# Altium project FIT_PM12_v1.1.PrjPcb (part 4 of 13)

## Sheet PM12_P3V3.SchDoc: FIT_PM12 board
size 420 x 297 mm; CheckedBy: G.Kasprowicz; Author: INR Moscow; CompanyName: WUT ISE; DrawnBy: M.Podgórski; Organization: WUT ISE; Address1: PW ISE; Address2: Nowowiejska 15/19 00-665 Warsaw; Address3: gkasprow@gmail.com; DocumentNumber: 16; Revision: 2; SheetNumber: 17; SheetTotal: 34; ModifiedBy: -; CheckedDate: -; Title2: P3V3 PSU; DivGrp: WUT ISE; Designer: INR RAS; ModifiedDate: -; ProjectName: Sensor Box
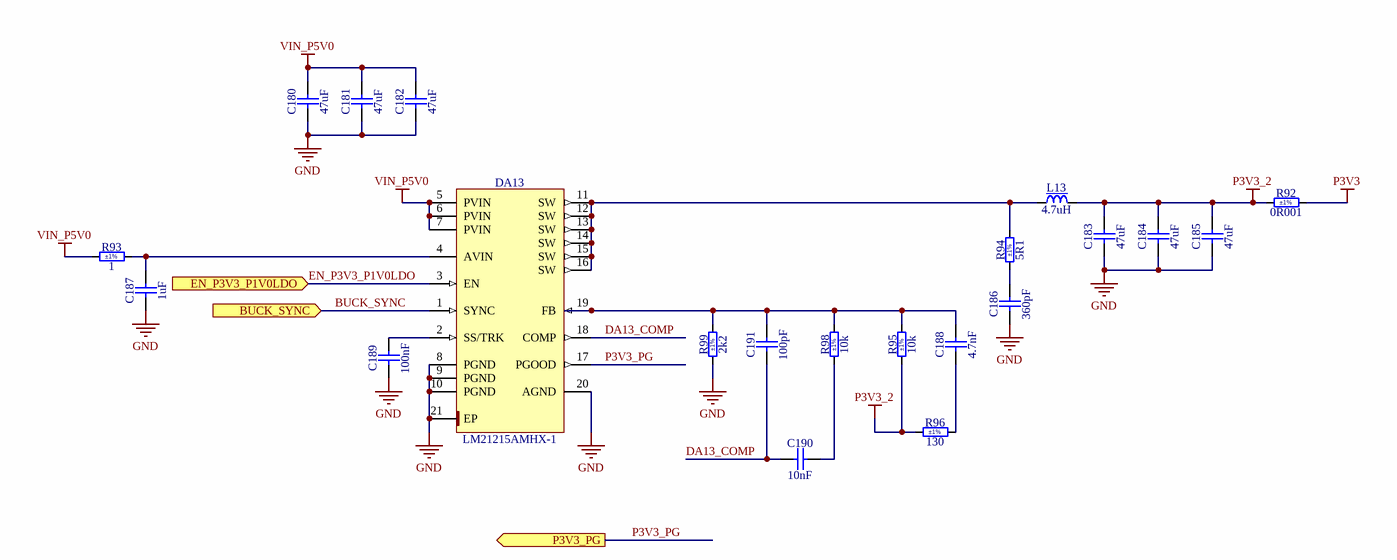
[diagram p9: PM12_P3V3.SchDoc]

### Parts
C180  47uF  [CAPC3225X270N]
C181  47uF  [CAPC3225X270N]
C182  47uF  [CAPC3225X270N]
C183  47uF  [CAPC3225X270N]
C184  47uF  [CAPC3225X270N]
C185  47uF  [CAPC3225X270N]
C186  360pF  [CAPC2013X145N]
C187  1uF  [CAPC2012X140N]
C188  4.7nF  [CAPC2012X135N]
C189  100nF  [CAPC2012X135N]
C190  10nF  [CAPC2012X135N]
C191  100pF  [CAPC2012X135N]
DA13  LM21215AMHX-1  [TEXAS_PWP0020AA]
L13  4.7uH  [INDM172170X700N]
R92  0R001  Tolerance: ±1%  [RESC_BOURNS_CRE2512_0R001-0R004]
R93  1  Tolerance: ±1%  [RESC2012X60N]
R94  5R1  Tolerance: ±1%  [RESC2012X60N]
R95  10k  Tolerance: ±1%  [RESC2012X60N]
R96  130  Tolerance: ±1%  [RESC2012X60N]
R98  10k  Tolerance: ±1%  [RESC2012X60N]
R99  2k2  Tolerance: ±1%  [RESC2012X60N]

### Ports
BUCK_SYNC (in), EN_P3V3_P1V0LDO (in), P3V3_PG (out)

### Nets
GND: C180.1 C181.1 C182.1 C183.1 C184.1 C185.1 C186.1 C187.1 C189.1 DA13.8(PGND) DA13.9(PGND) DA13.10(PGND) DA13.20(AGND) DA13.21(EP) R99.1
P3V3: C180.2 C181.2 C182.2 DA13.5(PVIN) DA13.6(PVIN) DA13.7(PVIN) R92.2 R93.1  [also labelled VIN_P5V0]
P3V3_2: C183.2 C184.2 C185.2 L13.2 R92.1 R95.1 R96.1
BUCK_SYNC: DA13.1(SYNC) ; port BUCK_SYNC
DA13_COMP: C190.1 C191.1 DA13.18(COMP)
EN_P3V3_P1V0LDO: DA13.3(EN) ; port EN_P3V3_P1V0LDO
P3V3_PG: DA13.17(PGOOD) ; port P3V3_PG
NetC186_2: C186.2 R94.1
NetC187_2: C187.2 DA13.4(AVIN) R93.2
NetC188_1: C188.1 R96.2
NetC188_2: C188.2 C191.2 DA13.19(FB) R95.2 R98.2 R99.2
NetC189_2: C189.2 DA13.2(SS/TRK)
NetC190_2: C190.2 R98.1
NetDA13_11: DA13.11(SW) DA13.12(SW) DA13.13(SW) DA13.14(SW) DA13.15(SW) DA13.16(SW) L13.1 R94.2

### Notes on the sheet
- Project/Equipment
- Document
- Designer
- Drawn by
- Check.by
- Copyright WUT ISE 2024.
  This documentation describes Open Hardware and is licensed under the CERN OHL v.2. You may redistribute and modify this documentation under the terms of the CERN OHL v.2. (http://ohwr.org/CERNOHL). This documentation is distributed WITHOUT ANY EXPRESS OR IMPLIED WARRANTY, INCLUDING OF MERCHANTABILITY, SATISFACTORY QUALITY AND FITNESS FOR A PARTICULAR PURPOSE. Please see the CERN OHL v.2 for applicable conditions.
- Contact
- File
- Last Mod.
- Print Date
- Sheet
- Size
- A3
- of
- Rev

### Library data of the parts
C180-C185 = CC1210_47UF_16V_20%_X5R: as C235 on sheet PM12_P3V8; Part Number: CC1210_47UF_16V_20%_X5R; Component Kind: Standard; Component Type: Standard; Pin Count: 2; Value: 47uF; Status: None; Manufacturer Part Number: CC1210_47UF_16V_20%_X5R; Case: 1210; Mounted: Yes; Socket: No; SMD: Yes; Sense: No; Manufacturer1 Example: TAIYO YUDEN; Manufacturer1 ComponentHeight: 2.7mm; HelpURL: \\cern.ch\dfs\Applications\Altium\Datasheets\CC1210_X5R_TAIYO-YUDEN_HIGH-VALUE.pdf; Author: CERN DEM MR; CreateDate: 03.02.2016; LatestRevisionDate: 03.02.2016
C186 = CC0805_360PF_50V_5%_C0G: as C248 on sheet PM12_P3V8; Part Number: CC0805_360PF_50V_5%_C0G; Component Kind: Standard; Component Type: Standard; Pin Count: 2; Value: 360pF; Status: None; Manufacturer Part Number: CC0805_360PF_50V_5%_C0G; Case: 0805; Mounted: Yes; Socket: No; SMD: Yes; Sense: No; Manufacturer1 Example: YAGEO PHYCOMP; Manufacturer1 ComponentHeight: 1.45mm; HelpURL: \\cern.ch\dfs\Applications\Altium\Datasheets\CC0805_NP0_YAGEO.pdf; Author: CERN DEM HF; CreateDate: 30.05.2024; LatestRevisionDate: 30.05.2024
C187 = CC0805_1UF_25V_10%_X7R: as C95 on sheet PM12_LDO; Part Number: CC0805_1UF_25V_10%_X7R; Component Kind: Standard; Component Type: Standard; Pin Count: 2; Value: 1uF; Status: Preferred; Manufacturer Part Number: CC0805_1UF_25V_10%_X7R; Case: 0805; Mounted: Yes; Socket: No; SMD: Yes; Sense: No; Manufacturer1 Example: KEMET; Manufacturer1 ComponentHeight: 1.4mm; HelpURL: \\cern.ch\dfs\Applications\Altium\Datasheets\CC0805_X7R_KEMET.pdf; Author: CERN DEM JLC; CreateDate: 23.03.2009; LatestRevisionDate: 23.03.2009
C188 = CC0805_4.7NF_50V_10%_X7R: as C250 on sheet PM12_P3V8; Part Number: CC0805_4.7NF_50V_10%_X7R; Component Kind: Standard; Component Type: Standard; Pin Count: 2; Value: 4.7nF; Status: Preferred; Manufacturer Part Number: CC0805_4.7NF_50V_10%_X7R; Case: 0805; Mounted: Yes; Socket: No; SMD: Yes; Sense: No; Manufacturer1 Example: PHYCOMP; Manufacturer1 ComponentHeight: 0.94mm; HelpURL: \\cern.ch\dfs\Applications\Altium\Datasheets\CC0805_X7R_PHYCOMP.pdf; Author: CERN DEM JLC; CreateDate: 03.12.2007; LatestRevisionDate: 03.12.2007
C189 = CC0805_100NF_50V_10%_X7R: as C251 on sheet PM12_P3V8; Part Number: CC0805_100NF_50V_10%_X7R; Component Kind: Standard; Component Type: Standard; Pin Count: 2; Value: 100nF; Status: None; Manufacturer Part Number: CC0805_100NF_50V_10%_X7R; Case: 0805; Mounted: Yes; Socket: No; SMD: Yes; Sense: No; Manufacturer1 Example: TDK; Manufacturer1 ComponentHeight: 1mm; HelpURL: \\cern.ch\dfs\Applications\Altium\Datasheets\CC0805_X7R_TDK_C.pdf; Author: CERN DEM JLC; CreateDate: 03.12.2007; LatestRevisionDate: 22.04.2015
C190 = CC0805_10NF_50V_10%_X7R: as C252 on sheet PM12_P3V8; Part Number: CC0805_10NF_50V_10%_X7R; Component Kind: Standard; Component Type: Standard; Pin Count: 2; Value: 10nF; Status: Preferred; Manufacturer Part Number: CC0805_10NF_50V_10%_X7R; Case: 0805; Mounted: Yes; Socket: No; SMD: Yes; Sense: No; Manufacturer1 Example: KEMET; Manufacturer1 ComponentHeight: 0.88mm; HelpURL: \\cern.ch\dfs\Applications\Altium\Datasheets\CC0805_X7R_KEMET.pdf; Author: CERN DEM JLC; CreateDate: 03.12.2007; LatestRevisionDate: 22.04.2015
C191 = CC0805_100PF_50V_5%_NP0: as C260 on sheet PM12_P3V8; Part Number: CC0805_100PF_50V_5%_NP0; Component Kind: Standard; Component Type: Standard; Pin Count: 2; Value: 100pF; Status: Preferred; Manufacturer Part Number: CC0805_100PF_50V_5%_NP0; Case: 0805; Mounted: Yes; Socket: No; SMD: Yes; Sense: No; Manufacturer1 Example: PHYCOMP; Manufacturer1 ComponentHeight: 1.35mm; HelpURL: \\cern.ch\dfs\Applications\Altium\Datasheets\CC0805_NP0_PHYCOMP.pdf; Author: CERN DEM JLC; CreateDate: 03.12.2007; LatestRevisionDate: 03.12.2007
DA13 = LM21215AMHX-1: 2.95-V To 5.5-V, 12-A, Voltage-Mode Synchronous Buck Regulator with Frequency Synchronization; Part Description: 2.95-V To 5.5-V, 15-A, Voltage-Mode Synchronous Buck Regulator with Frequency Synchronization; Manufacturer: TEXAS INSTRUMENTS; PressFit: No; Bonding: No; Part Number: LM21215AMHX-1; Component Kind: Standard; Component Type: Standard; Device: LM21215AMHX-1; PackageDescription: TEXAS Case Style PWP0020AA, SOP, 0.65mm Pitch; 20 Pin, 4.40mm W X 6.50mm L X 1.10mm H body (w/thermal tab 3.4mm X 4.6mm  ), IPC Medium Density; Manufacturer Part Number: LM21215AMHX-1; Pin Count: 21; Case: TSSOP20; Mounted: Yes; Socket: No; SMD: Yes; Sense: No; ComponentHeight: 1.1mm; HelpURL: \\cern.ch\dfs\Applications\Altium\Datasheets\LM21215AMHX-1.pdf; Author: CERN DEM HF; CreateDate: 05.06.2024; LatestRevisionDate: 05.06.2024
L13 = IND6767_4.7UH_20%_VISHAY_IHLP-6767GZ-11: Inductor With Core; Part Description: Low Profile, High Current IHLP® Inductor; Manufacturer: VISHAY DALE; Manufacturer Part Number: IHLP6767GZER4R7M11; Power: 30A; Resistance: 3.98mR; Tolerance: ±20%; Part Number: IND6767_4.7UH_20%_VISHAY_IHLP-6767GZ-11; Component Kind: Standard; Component Type: Standard; Pin Count: 2; Value: 4.7uH; Case: 6767; Mounted: Yes; Socket: No; SMD: Yes; Sense: No; ComponentHeight: 7mm; HelpURL: \\cern.ch\dfs\Applications\Altium\Datasheets\IND_VISHAY_IHLP-6767GZ-11.pdf; Author: CERN DEM HF; CreateDate: 04.06.2024; LatestRevisionDate: 04.06.2024
R92 = R2512_0R001_1%_3W_50PPM_BOURNS_CRE2512: as R15 on sheet PM12_P3V8; Part Number: R2512_0R001_1%_3W_50PPM_BOURNS_CRE2512; Component Kind: Standard; Component Type: Standard; Pin Count: 2; Value: 0R001; Status: None; Case: 2512; Mounted: Yes; Sense: No; Socket: No; SMD: Yes; ComponentHeight: 0.9mm; HelpURL: \\cern.ch\dfs\Applications\Altium\Datasheets\R2512_BOURNS_CRE2512.pdf; Author: CERN DEM BC; CreateDate: 13.10.2021; LatestRevisionDate: 13.10.2021
R93 = R0805_1R_1%_0.125W_100PPM: as R58 on sheet PM12_LDO; Part Number: R0805_1R_1%_0.125W_100PPM; Component Kind: Standard; Component Type: Standard; Pin Count: 2; Value: 1; Status: None; Manufacturer Part Number: R0805_1R_1%_0.125W_100PPM; Case: 0805; Mounted: Yes; Sense: No; Socket: No; SMD: Yes; Manufacturer1 Example: VISHAY; Manufacturer1 ComponentHeight: 0.6mm; HelpURL: \\cern.ch\dfs\Applications\Altium\Datasheets\R0805_VISHAY_CRCW e3.pdf; Author: CERN DEM HF; CreateDate: 07.06.2024; LatestRevisionDate: 07.06.2024
R94 = R0805_5R1_1%_0.125W_100PPM: as R18 on sheet PM12_P3V8; Part Number: R0805_5R1_1%_0.125W_100PPM; Component Kind: Standard; Component Type: Standard; Pin Count: 2; Value: 5R1; Status: None; Manufacturer Part Number: R0805_5R1_1%_0.125W_100PPM; Case: 0805; Mounted: Yes; Sense: No; Socket: No; SMD: Yes; Manufacturer1 Example: VISHAY; Manufacturer1 ComponentHeight: 0.6mm; HelpURL: \\cern.ch\dfs\Applications\Altium\Datasheets\R0805_VISHAY_CRCW-HP e3.pdf; Author: CERN DEM HF; CreateDate: 07.06.2024; LatestRevisionDate: 07.06.2024
R95 R98 = R0805_10K_1%_0.125W_100PPM: as R97 on sheet PM12_Supply_LED; Part Number: R0805_10K_1%_0.125W_100PPM; Component Kind: Standard; Component Type: Standard; Pin Count: 2; Value: 10k; Status: Preferred; Manufacturer Part Number: R0805_10K_1%_0.125W_100PPM; Case: 0805; Mounted: Yes; Sense: No; Socket: No; SMD: Yes; Manufacturer1 Example: NIC COMPONENT; Manufacturer1 ComponentHeight: 0.6mm; HelpURL: \\cern.ch\dfs\Applications\Altium\Datasheets\R0805_NIC_NRC.pdf; Author: CERN DEM JLC; CreateDate: 03.12.2007; LatestRevisionDate: 13.03.2008
R96 = R0805_130R_1%_0.125W_100PPM: as R139 on sheet PM12_P3V8; Part Number: R0805_130R_1%_0.125W_100PPM; Component Kind: Standard; Component Type: Standard; Pin Count: 2; Value: 130; Status: Preferred; Manufacturer Part Number: R0805_130R_1%_0.125W_100PPM; Case: 0805; Mounted: Yes; Sense: No; Socket: No; SMD: Yes; Manufacturer1 Example: NIC COMPONENT; Manufacturer1 ComponentHeight: 0.6mm; HelpURL: \\cern.ch\dfs\Applications\Altium\Datasheets\R0805_NIC_NRC.pdf; Author: CERN DEM JLC; CreateDate: 03.12.2007; LatestRevisionDate: 13.03.2008
R99 = R0805_2K2_1%_0.125W_100PPM: as R101 on sheet PM12_Supply_LED; Part Number: R0805_2K2_1%_0.125W_100PPM; Component Kind: Standard; Component Type: Standard; Pin Count: 2; Value: 2k2; Status: Preferred; Manufacturer Part Number: R0805_2K2_1%_0.125W_100PPM; Case: 0805; Mounted: Yes; Sense: No; Socket: No; SMD: Yes; Manufacturer1 Example: NIC COMPONENT; Manufacturer1 ComponentHeight: 0.6mm; HelpURL: \\cern.ch\dfs\Applications\Altium\Datasheets\R0805_NIC_NRC.pdf; Author: CERN DEM JLC; CreateDate: 03.12.2007; LatestRevisionDate: 13.03.2008

## Sheet PM12_N5V5.SchDoc: FIT_PM12 board
size 420 x 297 mm; CheckedBy: G.Kasprowicz; Author: INR Moscow; CompanyName: WUT ISE; DrawnBy: M.Podgórski; Organization: WUT ISE; Address1: PW ISE; Address2: Nowowiejska 15/19 00-665 Warsaw; Address3: gkasprow@gmail.com; DocumentNumber: 17; Revision: 2; SheetNumber: 18; SheetTotal: 34; ModifiedBy: -; CheckedDate: -; Title2: N5V5 PSU; DivGrp: WUT ISE; Designer: INR RAS; ModifiedDate: -; ProjectName: Sensor Box
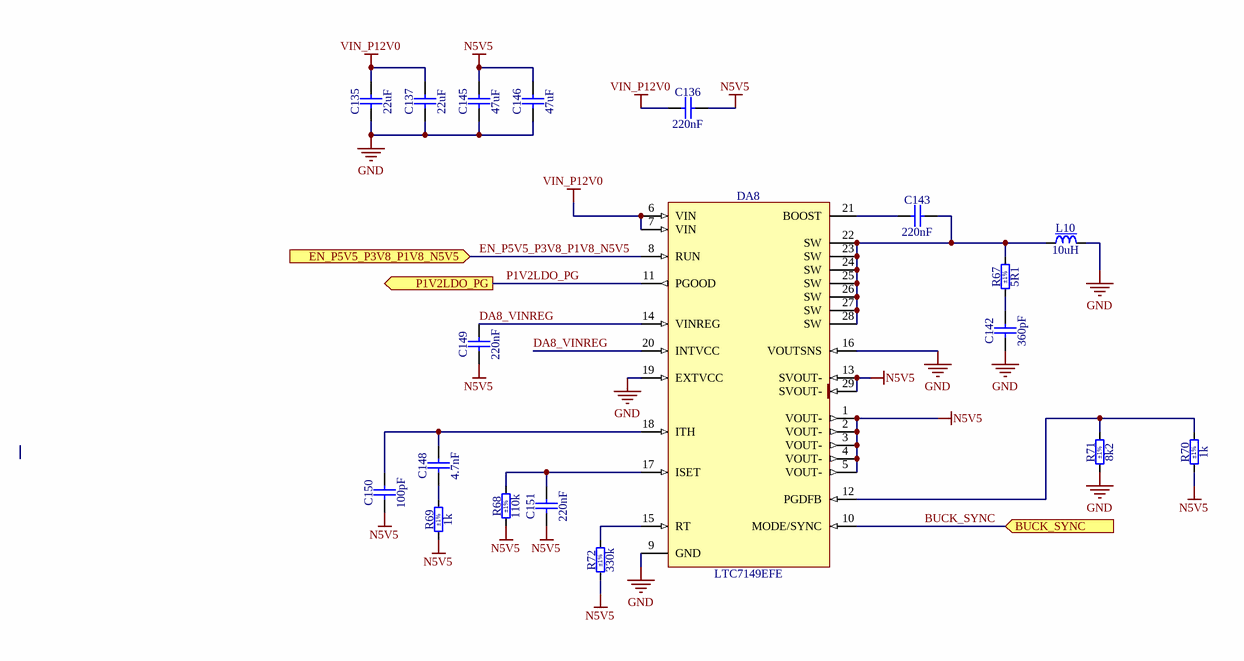
[diagram p10: PM12_N5V5.SchDoc]

### Parts
C135  22uF  [CAPC3216X180N]
C136  220nF  [CAPC2012X135N]
C137  22uF  [CAPC3216X180N]
C142  360pF  [CAPC2013X145N]
C143  220nF  [CAPC2012X135N]
C145  47uF  [CAPC3216X180N]
C146  47uF  [CAPC3216X180N]
C148  4.7nF  [CAPC2012X135N]
C149  220nF  [CAPC2012X135N]
C150  100pF  [CAPC2012X135N]
C151  220nF  [CAPC2012X135N]
DA8  LTC7149EFE  [SOP65P640X120-29N-R274X475]
L10  10uH  [IND_VISHAY_IHPL4040DZ-01]
R67  5R1  Tolerance: ±1%  [RESC2012X60N]
R68  110k  Tolerance: ±1%  [RESC2012X60N]
R69  1k  Tolerance: ±1%  [RESC2012X60N]
R70  1k  Tolerance: ±1%  [RESC2012X60N]
R71  8k2  Tolerance: ±1%  [RESC2012X60N]
R72  330k  Tolerance: ±1%  [RESC2012X60N]

### Ports
BUCK_SYNC (in), EN_P5V5_P3V8_P1V8_N5V5 (in), P1V2LDO_PG (out)

### Nets
GND: C135.1 C137.1 C142.1 C145.1 C146.1 DA8.9(GND) DA8.16(VOUTSNS) DA8.19(EXTVCC) L10.2 R71.1
N5V5: C136.2 C145.2 C146.2 C149.1 C150.1 C151.1 DA8.1(VOUT-) DA8.2(VOUT-) DA8.3(VOUT-) DA8.4(VOUT-) DA8.5(VOUT-) DA8.13(SVOUT-) DA8.29(SVOUT-) R68.1 R69.1 R70.1 R72.1
VIN_P12V0: C135.2 C136.1 C137.2 DA8.6(VIN) DA8.7(VIN)
BUCK_SYNC: DA8.10(MODE/SYNC) ; port BUCK_SYNC
DA8_VINREG: C149.2 DA8.14(VINREG) DA8.20(INTVCC)
EN_P5V5_P3V8_P1V8_N5V5: DA8.8(RUN) ; port EN_P5V5_P3V8_P1V8_N5V5
P1V2LDO_PG: DA8.11(PGOOD) ; port P1V2LDO_PG
NetC142_2: C142.2 R67.1
NetC143_1: C143.1 DA8.21(BOOST)
NetC143_2: C143.2 DA8.22(SW) DA8.23(SW) DA8.24(SW) DA8.25(SW) DA8.26(SW) DA8.27(SW) DA8.28(SW) L10.1 R67.2
NetC148_1: C148.1 R69.2
NetC148_2: C148.2 C150.2 DA8.18(ITH)
NetC151_2: C151.2 DA8.17(ISET) R68.2
NetDA8_12: DA8.12(PGDFB) R70.2 R71.2
NetDA8_15: DA8.15(RT) R72.2

### Notes on the sheet
- Project/Equipment
- Document
- Designer
- Drawn by
- Check.by
- Copyright WUT ISE 2024.
  This documentation describes Open Hardware and is licensed under the CERN OHL v.2. You may redistribute and modify this documentation under the terms of the CERN OHL v.2. (http://ohwr.org/CERNOHL). This documentation is distributed WITHOUT ANY EXPRESS OR IMPLIED WARRANTY, INCLUDING OF MERCHANTABILITY, SATISFACTORY QUALITY AND FITNESS FOR A PARTICULAR PURPOSE. Please see the CERN OHL v.2 for applicable conditions.
- Contact
- File
- Last Mod.
- Print Date
- Sheet
- Size
- A3
- of
- Rev

### Library data of the parts
C135 C137 = CC1206_22UF_25V_20%_X5R: as C80 on sheet PM12_LDO; Part Number: CC1206_22UF_25V_20%_X5R; Component Kind: Standard; Component Type: Standard; Pin Count: 2; Value: 22uF; Status: None; Manufacturer Part Number: CC1206_22UF_25V_20%_X5R; Case: 1206; Mounted: Yes; Socket: No; SMD: Yes; Sense: No; Manufacturer1 Example: TDK; Manufacturer1 ComponentHeight: 1.8mm; HelpURL: \\cern.ch\dfs\Applications\Altium\Datasheets\CC1206_X5R_TDK_C.pdf; Author: CERN DEM WB; CreateDate: 25.07.2018; LatestRevisionDate: 25.07.2018
C136 C143 C149 C151 = CC0805_220NF_50V_10%_X7R: as C194 on sheet PM12_LDO; Part Number: CC0805_220NF_50V_10%_X7R; Component Kind: Standard; Component Type: Standard; Pin Count: 2; Value: 220nF; Status: Preferred; Manufacturer Part Number: CC0805_220NF_50V_10%_X7R; Case: 0805; Mounted: Yes; Socket: No; SMD: Yes; Sense: No; Manufacturer1 Example: MURATA; Manufacturer1 ComponentHeight: 1.35mm; HelpURL: \\cern.ch\dfs\Applications\Altium\Datasheets\CC0805_X7R_MURATA.pdf; Author: CERN DEM JLC; CreateDate: 03.12.2007; LatestRevisionDate: 03.12.2007
C142 = CC0805_360PF_50V_5%_C0G: as C248 on sheet PM12_P3V8; Part Number: CC0805_360PF_50V_5%_C0G; Component Kind: Standard; Component Type: Standard; Pin Count: 2; Value: 360pF; Status: None; Manufacturer Part Number: CC0805_360PF_50V_5%_C0G; Case: 0805; Mounted: Yes; Socket: No; SMD: Yes; Sense: No; Manufacturer1 Example: YAGEO PHYCOMP; Manufacturer1 ComponentHeight: 1.45mm; HelpURL: \\cern.ch\dfs\Applications\Altium\Datasheets\CC0805_NP0_YAGEO.pdf; Author: CERN DEM HF; CreateDate: 30.05.2024; LatestRevisionDate: 30.05.2024
C145 C146 = CC1206_47UF_25V_20%_X5R: Non-polarised capacitor; Part Description: SMD Multilayer Chip Ceramic Capacitor; Manufacturer: GENERIC; Manufacturer1 Part Number: C3216X5R1E476M160; Voltage: 25V; TC: X5R; Tolerance: ±20%; Part Number: CC1206_47UF_25V_20%_X5R; Component Kind: Standard; Component Type: Standard; Pin Count: 2; Value: 47uF; Status: None; Manufacturer Part Number: CC1206_47UF_25V_20%_X5R; Case: 1206; Mounted: Yes; Socket: No; SMD: Yes; Sense: No; Manufacturer1 Example: TDK; Manufacturer1 ComponentHeight: 1.8mm; HelpURL: \\cern.ch\dfs\Applications\Altium\Datasheets\CC1206_X5R_TDK_C.pdf; Author: CERN DEM JLC; CreateDate: 20.11.2013; LatestRevisionDate: 14.03.2017
C148 = CC0805_4.7NF_50V_10%_X7R: as C250 on sheet PM12_P3V8; Part Number: CC0805_4.7NF_50V_10%_X7R; Component Kind: Standard; Component Type: Standard; Pin Count: 2; Value: 4.7nF; Status: Preferred; Manufacturer Part Number: CC0805_4.7NF_50V_10%_X7R; Case: 0805; Mounted: Yes; Socket: No; SMD: Yes; Sense: No; Manufacturer1 Example: PHYCOMP; Manufacturer1 ComponentHeight: 0.94mm; HelpURL: \\cern.ch\dfs\Applications\Altium\Datasheets\CC0805_X7R_PHYCOMP.pdf; Author: CERN DEM JLC; CreateDate: 03.12.2007; LatestRevisionDate: 03.12.2007
C150 = CC0805_100PF_50V_5%_NP0: as C260 on sheet PM12_P3V8; Part Number: CC0805_100PF_50V_5%_NP0; Component Kind: Standard; Component Type: Standard; Pin Count: 2; Value: 100pF; Status: Preferred; Manufacturer Part Number: CC0805_100PF_50V_5%_NP0; Case: 0805; Mounted: Yes; Socket: No; SMD: Yes; Sense: No; Manufacturer1 Example: PHYCOMP; Manufacturer1 ComponentHeight: 1.35mm; HelpURL: \\cern.ch\dfs\Applications\Altium\Datasheets\CC0805_NP0_PHYCOMP.pdf; Author: CERN DEM JLC; CreateDate: 03.12.2007; LatestRevisionDate: 03.12.2007
DA8 = LTC7149EFE: 60V, 4A Synchronous  Step-Down Regulator for Inverting Outputs; Manufacturer: LINEAR TECHNOLOGY; PressFit: No; Bonding: No; Part Number: LTC7149EFE; Component Kind: Standard; Component Type: Standard; Device: LTC7149EFE; PackageDescription: SOP, 0.65mm pitch; 28 pin, 4.50mm W X 9.70mm L (thermal tab 4.75 X 2.74mm), IPC Medium Density; Part Description: 60V, 4A Synchronous Step-Down Regulator for Inverting Outputs; Manufacturer Part Number: LTC7149EFE; Pin Count: 29; Case: SOP28; Mounted: Yes; Socket: No; SMD: Yes; Sense: No; ComponentHeight: 1.2mm; HelpURL: \\cern.ch\dfs\Applications\Altium\Datasheets\LTC7149.pdf; Author: CERN DEM HF; CreateDate: 06.06.2024; LatestRevisionDate: 06.06.2024
L10 = IND4040_10UH_20%_VISHAY_IHLP-4040DZ-01: as L15 on sheet PM12_P3V8; Part Number: IND4040_10UH_20%_VISHAY_IHLP-4040DZ-01; Component Kind: Standard; Component Type: Standard; Pin Count: 2; Value: 10uH; Case: 4040; Mounted: Yes; Socket: No; SMD: Yes; Sense: No; ComponentHeight: 4mm; HelpURL: \\cern.ch\dfs\Applications\Altium\Datasheets\IND_VISHAY_IHLP4040DZ-01.pdf; Author: CERN DEM HF; CreateDate: 31.05.2024; LatestRevisionDate: 31.05.2024
R67 = R0805_5R1_1%_0.125W_100PPM: as R18 on sheet PM12_P3V8; Part Number: R0805_5R1_1%_0.125W_100PPM; Component Kind: Standard; Component Type: Standard; Pin Count: 2; Value: 5R1; Status: None; Manufacturer Part Number: R0805_5R1_1%_0.125W_100PPM; Case: 0805; Mounted: Yes; Sense: No; Socket: No; SMD: Yes; Manufacturer1 Example: VISHAY; Manufacturer1 ComponentHeight: 0.6mm; HelpURL: \\cern.ch\dfs\Applications\Altium\Datasheets\R0805_VISHAY_CRCW-HP e3.pdf; Author: CERN DEM HF; CreateDate: 07.06.2024; LatestRevisionDate: 07.06.2024
R68 = R0805_110K_1%_0.125W_100PPM: Resistor - 1%; Part Description: General Purpose Thick Film Chip Resistor; Manufacturer: GENERIC; Manufacturer1 Part Number: NRC10F1103TRF; Power: 0.125W; TC: ±100ppm/°C; PressFit: No; Part Number: R0805_110K_1%_0.125W_100PPM; Component Kind: Standard; Component Type: Standard; Pin Count: 2; Value: 110k; Status: Preferred; Manufacturer Part Number: R0805_110K_1%_0.125W_100PPM; Case: 0805; Mounted: Yes; Sense: No; Socket: No; SMD: Yes; Manufacturer1 Example: NIC COMPONENT; Manufacturer1 ComponentHeight: 0.6mm; HelpURL: \\cern.ch\dfs\Applications\Altium\Datasheets\R0805_NIC_NRC.pdf; Author: CERN DEM JLC; CreateDate: 03.12.2007; LatestRevisionDate: 13.03.2008
R69 R70 = R0805_1K_1%_0.125W_100PPM: as R66 on sheet PM12_LDO; Part Number: R0805_1K_1%_0.125W_100PPM; Component Kind: Standard; Component Type: Standard; Pin Count: 2; Value: 1k; Status: Preferred; Manufacturer Part Number: R0805_1K_1%_0.125W_100PPM; Case: 0805; Mounted: Yes; Sense: No; Socket: No; SMD: Yes; Manufacturer1 Example: NIC COMPONENT; Manufacturer1 ComponentHeight: 0.6mm; HelpURL: \\cern.ch\dfs\Applications\Altium\Datasheets\R0805_NIC_NRC.pdf; Author: CERN DEM JLC; CreateDate: 03.12.2007; LatestRevisionDate: 13.03.2008
R71 = R0805_8K2_1%_0.125W_100PPM: Resistor - 1%; Part Description: General Purpose Thick Film Chip Resistor; Manufacturer: GENERIC; Manufacturer1 Part Number: NRC10F8201TRF; Power: 0.125W; TC: ±100ppm/°C; PressFit: No; Part Number: R0805_8K2_1%_0.125W_100PPM; Component Kind: Standard; Component Type: Standard; Pin Count: 2; Value: 8k2; Status: Preferred; Manufacturer Part Number: R0805_8K2_1%_0.125W_100PPM; Case: 0805; Mounted: Yes; Sense: No; Socket: No; SMD: Yes; Manufacturer1 Example: NIC COMPONENT; Manufacturer1 ComponentHeight: 0.6mm; HelpURL: \\cern.ch\dfs\Applications\Altium\Datasheets\R0805_NIC_NRC.pdf; Author: CERN DEM JLC; CreateDate: 03.12.2007; LatestRevisionDate: 13.03.2008
R72 = R0805_330K_1%_0.125W_100PPM: Resistor - 1%; Part Description: General Purpose Thick Film Chip Resistor; Manufacturer: GENERIC; Manufacturer1 Part Number: NRC10F3303TRF; Power: 0.125W; TC: ±100ppm/°C; PressFit: No; Part Number: R0805_330K_1%_0.125W_100PPM; Component Kind: Standard; Component Type: Standard; Pin Count: 2; Value: 330k; Status: Preferred; Manufacturer Part Number: R0805_330K_1%_0.125W_100PPM; Case: 0805; Mounted: Yes; Sense: No; Socket: No; SMD: Yes; Manufacturer1 Example: NIC COMPONENT; Manufacturer1 ComponentHeight: 0.6mm; HelpURL: \\cern.ch\dfs\Applications\Altium\Datasheets\R0805_NIC_NRC.pdf; Author: CERN DEM JLC; CreateDate: 03.12.2007; LatestRevisionDate: 13.03.2008

## Sheet PM12_P5V5.SchDoc: FIT_PM12 board
size 420 x 297 mm; CheckedBy: G.Kasprowicz; Author: INR Moscow; CompanyName: WUT ISE; DrawnBy: M.Podgórski; Organization: WUT ISE; Address1: PW ISE; Address2: Nowowiejska 15/19 00-665 Warsaw; Address3: gkasprow@gmail.com; DocumentNumber: 18; Revision: 2; SheetNumber: 19; SheetTotal: 34; ModifiedBy: -; CheckedDate: -; Title2: P5V5 PSU; DivGrp: WUT ISE; Designer: INR RAS; ModifiedDate: -; ProjectName: Sensor Box
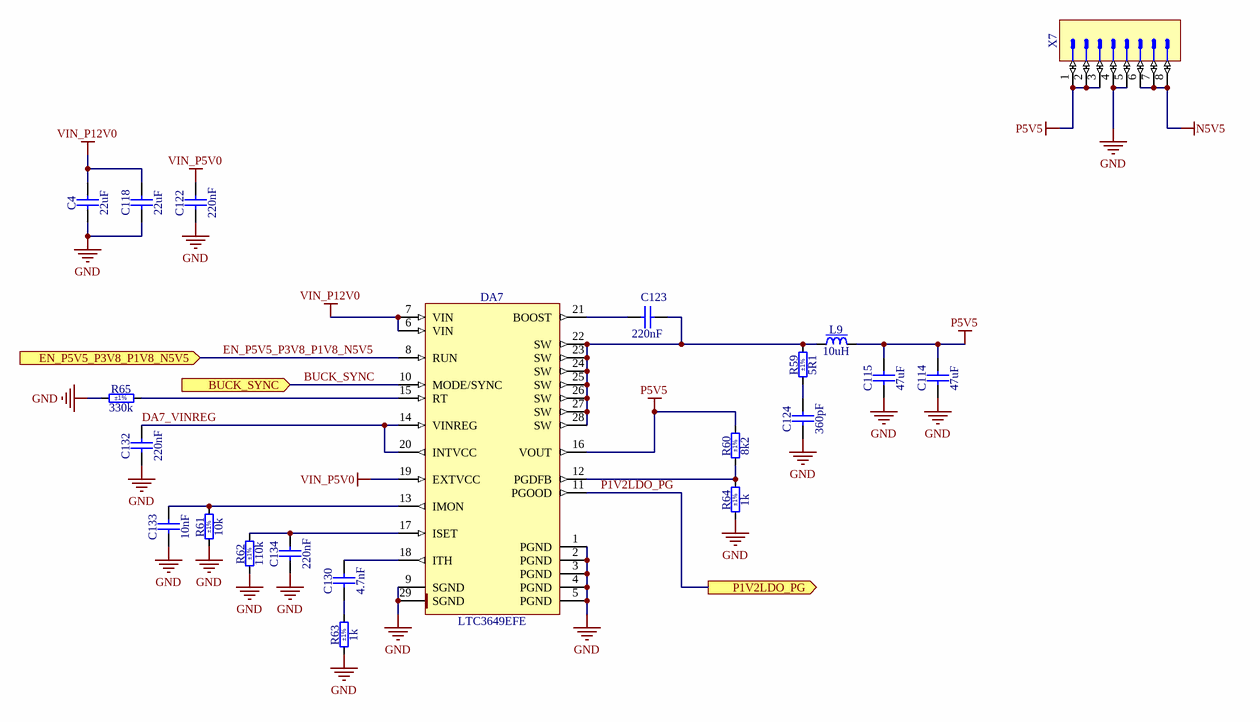
[diagram p11: PM12_P5V5.SchDoc]

### Parts
C4  22uF  [CAPC3216X180N]
C114  47uF  [CAPC3225X270N]
C115  47uF  [CAPC3225X270N]
C118  22uF  [CAPC3216X180N]
C122  220nF  [CAPC2012X135N]
C123  220nF  [CAPC2012X135N]
C124  360pF  [CAPC2013X145N]
C130  4.7nF  [CAPC2012X135N]
C132  220nF  [CAPC2012X135N]
C133  10nF  [CAPC2012X135N]
C134  220nF  [CAPC2012X135N]
DA7  LTC3649EFE  [SOP65P640X120-29N-R274X475]
L9  10uH  [IND_VISHAY_IHPL4040DZ-01]
R59  5R1  Tolerance: ±1%  [RESC2012X60N]
R60  8k2  Tolerance: ±1%  [RESC2012X60N]
R61  10k  Tolerance: ±1%  [RESC2012X60N]
R62  110k  Tolerance: ±1%  [RESC2012X60N]
R63  1k  Tolerance: ±1%  [RESC2012X60N]
R64  1k  Tolerance: ±1%  [RESC2012X60N]
R65  330k  Tolerance: ±1%  [RESC2012X60N]
X7  Header 8  [SAMTEC_DW-08-09-L-S-470]  (value not drawn)

### Ports
BUCK_SYNC (in), EN_P5V5_P3V8_P1V8_N5V5 (in), P1V2LDO_PG (out)

### Nets
GND: C4.1 C114.1 C115.1 C118.1 C122.1 C124.1 C132.1 C133.1 C134.1 DA7.1(PGND) DA7.2(PGND) DA7.3(PGND) DA7.4(PGND) DA7.5(PGND) DA7.9(SGND) DA7.29(SGND) R61.1 R62.1 R63.1 R64.1 R65.1 X7.4 X7.5
N5V5: X7.6 X7.7 X7.8
P5V5: C114.2 C115.2 DA7.16(VOUT) L9.2 R60.2 X7.1 X7.2 X7.3
VIN_P5V0: C122.2 DA7.19(EXTVCC)  [project net P3V3]
VIN_P12V0: C4.2 C118.2 DA7.6(VIN) DA7.7(VIN)
BUCK_SYNC: DA7.10(MODE/SYNC) ; port BUCK_SYNC
DA7_VINREG: C132.2 DA7.14(VINREG) DA7.20(INTVCC)
EN_P5V5_P3V8_P1V8_N5V5: DA7.8(RUN) ; port EN_P5V5_P3V8_P1V8_N5V5
P1V2LDO_PG: DA7.11(PGOOD) ; port P1V2LDO_PG
NetC123_1: C123.1 DA7.21(BOOST)
NetC123_2: C123.2 DA7.22(SW) DA7.23(SW) DA7.24(SW) DA7.25(SW) DA7.26(SW) DA7.27(SW) DA7.28(SW) L9.1 R59.2
NetC124_2: C124.2 R59.1
NetC130_1: C130.1 R63.2
NetC130_2: C130.2 DA7.18(ITH)
NetC133_2: C133.2 DA7.13(IMON) R61.2
NetC134_2: C134.2 DA7.17(ISET) R62.2
NetDA7_12: DA7.12(PGDFB) R60.1 R64.2
NetDA7_15: DA7.15(RT) R65.2

### Notes on the sheet
- Project/Equipment
- Document
- Designer
- Drawn by
- Check.by
- Copyright WUT ISE 2024.
  This documentation describes Open Hardware and is licensed under the CERN OHL v.2. You may redistribute and modify this documentation under the terms of the CERN OHL v.2. (http://ohwr.org/CERNOHL). This documentation is distributed WITHOUT ANY EXPRESS OR IMPLIED WARRANTY, INCLUDING OF MERCHANTABILITY, SATISFACTORY QUALITY AND FITNESS FOR A PARTICULAR PURPOSE. Please see the CERN OHL v.2 for applicable conditions.
- Contact
- File
- Last Mod.
- Print Date
- Sheet
- Size
- A3
- of
- Rev

### Library data of the parts
C4 C118 = CC1206_22UF_25V_20%_X5R: as C80 on sheet PM12_LDO; Part Number: CC1206_22UF_25V_20%_X5R; Component Kind: Standard; Component Type: Standard; Pin Count: 2; Value: 22uF; Status: None; Manufacturer Part Number: CC1206_22UF_25V_20%_X5R; Case: 1206; Mounted: Yes; Socket: No; SMD: Yes; Sense: No; Manufacturer1 Example: TDK; Manufacturer1 ComponentHeight: 1.8mm; HelpURL: \\cern.ch\dfs\Applications\Altium\Datasheets\CC1206_X5R_TDK_C.pdf; Author: CERN DEM WB; CreateDate: 25.07.2018; LatestRevisionDate: 25.07.2018
C114 C115 = CC1210_47UF_16V_20%_X5R: as C235 on sheet PM12_P3V8; Part Number: CC1210_47UF_16V_20%_X5R; Component Kind: Standard; Component Type: Standard; Pin Count: 2; Value: 47uF; Status: None; Manufacturer Part Number: CC1210_47UF_16V_20%_X5R; Case: 1210; Mounted: Yes; Socket: No; SMD: Yes; Sense: No; Manufacturer1 Example: TAIYO YUDEN; Manufacturer1 ComponentHeight: 2.7mm; HelpURL: \\cern.ch\dfs\Applications\Altium\Datasheets\CC1210_X5R_TAIYO-YUDEN_HIGH-VALUE.pdf; Author: CERN DEM MR; CreateDate: 03.02.2016; LatestRevisionDate: 03.02.2016
C122 C123 C132 C134 = CC0805_220NF_50V_10%_X7R: as C194 on sheet PM12_LDO; Part Number: CC0805_220NF_50V_10%_X7R; Component Kind: Standard; Component Type: Standard; Pin Count: 2; Value: 220nF; Status: Preferred; Manufacturer Part Number: CC0805_220NF_50V_10%_X7R; Case: 0805; Mounted: Yes; Socket: No; SMD: Yes; Sense: No; Manufacturer1 Example: MURATA; Manufacturer1 ComponentHeight: 1.35mm; HelpURL: \\cern.ch\dfs\Applications\Altium\Datasheets\CC0805_X7R_MURATA.pdf; Author: CERN DEM JLC; CreateDate: 03.12.2007; LatestRevisionDate: 03.12.2007
C124 = CC0805_360PF_50V_5%_C0G: as C248 on sheet PM12_P3V8; Part Number: CC0805_360PF_50V_5%_C0G; Component Kind: Standard; Component Type: Standard; Pin Count: 2; Value: 360pF; Status: None; Manufacturer Part Number: CC0805_360PF_50V_5%_C0G; Case: 0805; Mounted: Yes; Socket: No; SMD: Yes; Sense: No; Manufacturer1 Example: YAGEO PHYCOMP; Manufacturer1 ComponentHeight: 1.45mm; HelpURL: \\cern.ch\dfs\Applications\Altium\Datasheets\CC0805_NP0_YAGEO.pdf; Author: CERN DEM HF; CreateDate: 30.05.2024; LatestRevisionDate: 30.05.2024
C130 = CC0805_4.7NF_50V_10%_X7R: as C250 on sheet PM12_P3V8; Part Number: CC0805_4.7NF_50V_10%_X7R; Component Kind: Standard; Component Type: Standard; Pin Count: 2; Value: 4.7nF; Status: Preferred; Manufacturer Part Number: CC0805_4.7NF_50V_10%_X7R; Case: 0805; Mounted: Yes; Socket: No; SMD: Yes; Sense: No; Manufacturer1 Example: PHYCOMP; Manufacturer1 ComponentHeight: 0.94mm; HelpURL: \\cern.ch\dfs\Applications\Altium\Datasheets\CC0805_X7R_PHYCOMP.pdf; Author: CERN DEM JLC; CreateDate: 03.12.2007; LatestRevisionDate: 03.12.2007
C133 = CC0805_10NF_50V_10%_X7R: as C252 on sheet PM12_P3V8; Part Number: CC0805_10NF_50V_10%_X7R; Component Kind: Standard; Component Type: Standard; Pin Count: 2; Value: 10nF; Status: Preferred; Manufacturer Part Number: CC0805_10NF_50V_10%_X7R; Case: 0805; Mounted: Yes; Socket: No; SMD: Yes; Sense: No; Manufacturer1 Example: KEMET; Manufacturer1 ComponentHeight: 0.88mm; HelpURL: \\cern.ch\dfs\Applications\Altium\Datasheets\CC0805_X7R_KEMET.pdf; Author: CERN DEM JLC; CreateDate: 03.12.2007; LatestRevisionDate: 22.04.2015
DA7 = LTC3649EFE: 60V, 4A Synchronous Step-Down Regulator with Rail-to-Rail Programmable Output; Manufacturer: LINEAR TECHNOLOGY; PressFit: No; Bonding: No; Part Number: LTC3649EFE; Component Kind: Standard; Component Type: Standard; Device: LTC3649EFE; PackageDescription: SOP, 0.65mm pitch; 28 pin, 4.50mm W X 9.70mm L (thermal tab 4.75 X 2.74mm), IPC Medium Density; Part Description: 60V, 4A Synchronous Step-Down Regulator with Rail-to-Rail Programmable Output; Manufacturer Part Number: LTC3649EFE; Pin Count: 29; Case: SOP28; Mounted: Yes; Socket: No; SMD: Yes; Sense: No; ComponentHeight: 1.2mm; HelpURL: \\cern.ch\dfs\Applications\Altium\Datasheets\LTC3649.pdf; Author: CERN DEM HF; CreateDate: 05.06.2024; LatestRevisionDate: 05.06.2024
L9 = IND4040_10UH_20%_VISHAY_IHLP-4040DZ-01: as L15 on sheet PM12_P3V8; Part Number: IND4040_10UH_20%_VISHAY_IHLP-4040DZ-01; Component Kind: Standard; Component Type: Standard; Pin Count: 2; Value: 10uH; Case: 4040; Mounted: Yes; Socket: No; SMD: Yes; Sense: No; ComponentHeight: 4mm; HelpURL: \\cern.ch\dfs\Applications\Altium\Datasheets\IND_VISHAY_IHLP4040DZ-01.pdf; Author: CERN DEM HF; CreateDate: 31.05.2024; LatestRevisionDate: 31.05.2024
R59 = R0805_5R1_1%_0.125W_100PPM: as R18 on sheet PM12_P3V8; Part Number: R0805_5R1_1%_0.125W_100PPM; Component Kind: Standard; Component Type: Standard; Pin Count: 2; Value: 5R1; Status: None; Manufacturer Part Number: R0805_5R1_1%_0.125W_100PPM; Case: 0805; Mounted: Yes; Sense: No; Socket: No; SMD: Yes; Manufacturer1 Example: VISHAY; Manufacturer1 ComponentHeight: 0.6mm; HelpURL: \\cern.ch\dfs\Applications\Altium\Datasheets\R0805_VISHAY_CRCW-HP e3.pdf; Author: CERN DEM HF; CreateDate: 07.06.2024; LatestRevisionDate: 07.06.2024
R60 = R0805_8K2_1%_0.125W_100PPM: as R71 on sheet PM12_N5V5; Part Number: R0805_8K2_1%_0.125W_100PPM; Component Kind: Standard; Component Type: Standard; Pin Count: 2; Value: 8k2; Status: Preferred; Manufacturer Part Number: R0805_8K2_1%_0.125W_100PPM; Case: 0805; Mounted: Yes; Sense: No; Socket: No; SMD: Yes; Manufacturer1 Example: NIC COMPONENT; Manufacturer1 ComponentHeight: 0.6mm; HelpURL: \\cern.ch\dfs\Applications\Altium\Datasheets\R0805_NIC_NRC.pdf; Author: CERN DEM JLC; CreateDate: 03.12.2007; LatestRevisionDate: 13.03.2008
R61 = R0805_10K_1%_0.125W_100PPM: as R97 on sheet PM12_Supply_LED; Part Number: R0805_10K_1%_0.125W_100PPM; Component Kind: Standard; Component Type: Standard; Pin Count: 2; Value: 10k; Status: Preferred; Manufacturer Part Number: R0805_10K_1%_0.125W_100PPM; Case: 0805; Mounted: Yes; Sense: No; Socket: No; SMD: Yes; Manufacturer1 Example: NIC COMPONENT; Manufacturer1 ComponentHeight: 0.6mm; HelpURL: \\cern.ch\dfs\Applications\Altium\Datasheets\R0805_NIC_NRC.pdf; Author: CERN DEM JLC; CreateDate: 03.12.2007; LatestRevisionDate: 13.03.2008
R62 = R0805_110K_1%_0.125W_100PPM: as R68 on sheet PM12_N5V5; Part Number: R0805_110K_1%_0.125W_100PPM; Component Kind: Standard; Component Type: Standard; Pin Count: 2; Value: 110k; Status: Preferred; Manufacturer Part Number: R0805_110K_1%_0.125W_100PPM; Case: 0805; Mounted: Yes; Sense: No; Socket: No; SMD: Yes; Manufacturer1 Example: NIC COMPONENT; Manufacturer1 ComponentHeight: 0.6mm; HelpURL: \\cern.ch\dfs\Applications\Altium\Datasheets\R0805_NIC_NRC.pdf; Author: CERN DEM JLC; CreateDate: 03.12.2007; LatestRevisionDate: 13.03.2008
R63 R64 = R0805_1K_1%_0.125W_100PPM: as R66 on sheet PM12_LDO; Part Number: R0805_1K_1%_0.125W_100PPM; Component Kind: Standard; Component Type: Standard; Pin Count: 2; Value: 1k; Status: Preferred; Manufacturer Part Number: R0805_1K_1%_0.125W_100PPM; Case: 0805; Mounted: Yes; Sense: No; Socket: No; SMD: Yes; Manufacturer1 Example: NIC COMPONENT; Manufacturer1 ComponentHeight: 0.6mm; HelpURL: \\cern.ch\dfs\Applications\Altium\Datasheets\R0805_NIC_NRC.pdf; Author: CERN DEM JLC; CreateDate: 03.12.2007; LatestRevisionDate: 13.03.2008
R65 = R0805_330K_1%_0.125W_100PPM: as R72 on sheet PM12_N5V5; Part Number: R0805_330K_1%_0.125W_100PPM; Component Kind: Standard; Component Type: Standard; Pin Count: 2; Value: 330k; Status: Preferred; Manufacturer Part Number: R0805_330K_1%_0.125W_100PPM; Case: 0805; Mounted: Yes; Sense: No; Socket: No; SMD: Yes; Manufacturer1 Example: NIC COMPONENT; Manufacturer1 ComponentHeight: 0.6mm; HelpURL: \\cern.ch\dfs\Applications\Altium\Datasheets\R0805_NIC_NRC.pdf; Author: CERN DEM JLC; CreateDate: 03.12.2007; LatestRevisionDate: 13.03.2008
X7 = SAMTEC_DW-08-09-L-S-470: Connector 8 Male; Part Description: 8 Contacts, Pitch 2.54mm, Single Row Straight .Flex Stack, Flexible Board Stacker (Stacker Height = 11,938mm); Manufacturer: SAMTEC; PressFit: No; Part Number: SAMTEC_DW-08-09-L-S-470; Component Kind: Standard; Component Type: Standard; Pin Count: 8; Family: Header 8; Mounted: Yes; Socket: No; SMD: No; Sense: No; Status: None; Manufacturer Part Number: DW-08-09-L-S-470; ComponentHeight: 15.75mm; HelpURL: \\cern.ch\dfs\Applications\Altium\Datasheets\SAMTEC_DW.pdf; Author: CERN DEM HF; CreateDate: 06.06.2024; LatestRevisionDate: 06.06.2024

## Sheet PM12_P1V0.SchDoc: FIT_PM12 board
size 420 x 297 mm; CheckedBy: G.Kasprowicz; Author: INR Moscow; CompanyName: WUT ISE; DrawnBy: M.Podgórski; Organization: WUT ISE; Address1: PW ISE; Address2: Nowowiejska 15/19 00-665 Warsaw; Address3: gkasprow@gmail.com; DocumentNumber: 19; Revision: 2; SheetNumber: 20; SheetTotal: 34; ModifiedBy: -; CheckedDate: -; Title2: P1V0 PSU; DivGrp: WUT ISE; Designer: INR RAS; ModifiedDate: -; ProjectName: Sensor Box
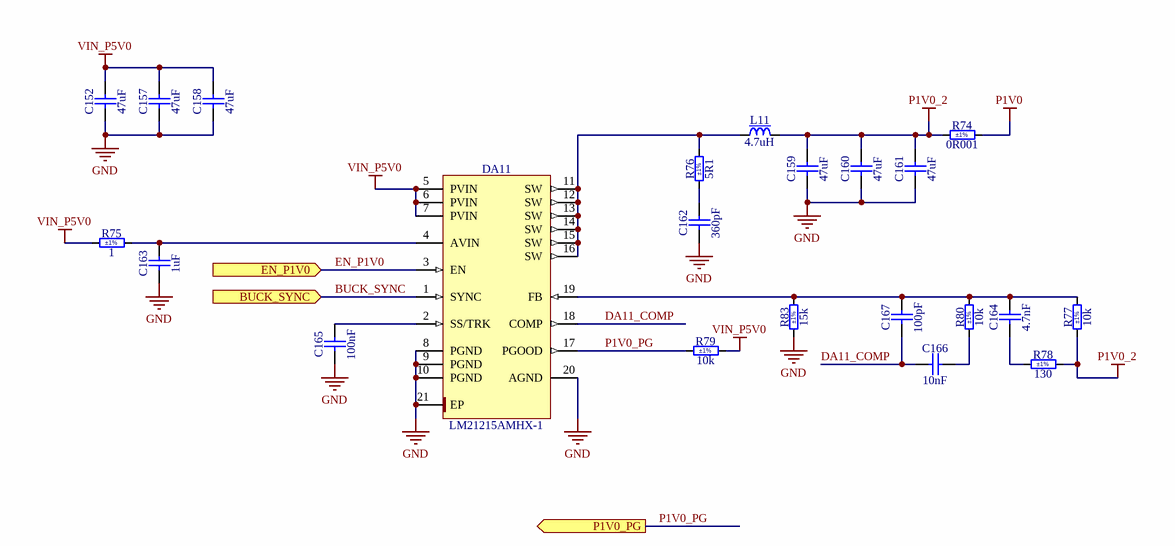
[diagram p12: PM12_P1V0.SchDoc]

### Parts
C152  47uF  [CAPC3225X270N]
C157  47uF  [CAPC3225X270N]
C158  47uF  [CAPC3225X270N]
C159  47uF  [CAPC3225X270N]
C160  47uF  [CAPC3225X270N]
C161  47uF  [CAPC3225X270N]
C162  360pF  [CAPC2013X145N]
C163  1uF  [CAPC2012X140N]
C164  4.7nF  [CAPC2012X135N]
C165  100nF  [CAPC2012X135N]
C166  10nF  [CAPC2012X135N]
C167  100pF  [CAPC2012X135N]
DA11  LM21215AMHX-1  [TEXAS_PWP0020AA]
L11  4.7uH  [INDM172170X700N]
R74  0R001  Tolerance: ±1%  [RESC_BOURNS_CRE2512_0R001-0R004]
R75  1  Tolerance: ±1%  [RESC2012X60N]
R76  5R1  Tolerance: ±1%  [RESC2012X60N]
R77  10k  Tolerance: ±1%  [RESC2012X60N]
R78  130  Tolerance: ±1%  [RESC2012X60N]
R79  10k  Tolerance: ±1%  [RESC2012X60N]
R80  10k  Tolerance: ±1%  [RESC2012X60N]
R83  15k  Tolerance: ±1%  [RESC2012X60N]

### Ports
BUCK_SYNC (in), EN_P1V0 (in), P1V0_PG (out)

### Nets
GND: C152.1 C157.1 C158.1 C159.1 C160.1 C161.1 C162.1 C163.1 C165.1 DA11.8(PGND) DA11.9(PGND) DA11.10(PGND) DA11.20(AGND) DA11.21(EP) R83.1
P1V0: R74.2
P1V0_2: C159.2 C160.2 C161.2 L11.2 R74.1 R77.1 R78.2
VIN_P5V0: C152.2 C157.2 C158.2 DA11.5(PVIN) DA11.6(PVIN) DA11.7(PVIN) R75.1 R79.2  [project net P3V3]
BUCK_SYNC: DA11.1(SYNC) ; port BUCK_SYNC
DA11_COMP: C166.1 C167.1 DA11.18(COMP)
EN_P1V0: DA11.3(EN) ; port EN_P1V0
P1V0_PG: DA11.17(PGOOD) R79.1 ; port P1V0_PG
NetC162_2: C162.2 R76.1
NetC163_2: C163.2 DA11.4(AVIN) R75.2
NetC164_1: C164.1 R78.1
NetC164_2: C164.2 C167.2 DA11.19(FB) R77.2 R80.2 R83.2
NetC165_2: C165.2 DA11.2(SS/TRK)
NetC166_2: C166.2 R80.1
NetDA11_11: DA11.11(SW) DA11.12(SW) DA11.13(SW) DA11.14(SW) DA11.15(SW) DA11.16(SW) L11.1 R76.2

### Notes on the sheet
- Project/Equipment
- Document
- Designer
- Drawn by
- Check.by
- Copyright WUT ISE 2024.
  This documentation describes Open Hardware and is licensed under the CERN OHL v.2. You may redistribute and modify this documentation under the terms of the CERN OHL v.2. (http://ohwr.org/CERNOHL). This documentation is distributed WITHOUT ANY EXPRESS OR IMPLIED WARRANTY, INCLUDING OF MERCHANTABILITY, SATISFACTORY QUALITY AND FITNESS FOR A PARTICULAR PURPOSE. Please see the CERN OHL v.2 for applicable conditions.
- Contact
- File
- Last Mod.
- Print Date
- Sheet
- Size
- A3
- of
- Rev

### Library data of the parts
C152 C157-C161 = CC1210_47UF_16V_20%_X5R: as C235 on sheet PM12_P3V8; Part Number: CC1210_47UF_16V_20%_X5R; Component Kind: Standard; Component Type: Standard; Pin Count: 2; Value: 47uF; Status: None; Manufacturer Part Number: CC1210_47UF_16V_20%_X5R; Case: 1210; Mounted: Yes; Socket: No; SMD: Yes; Sense: No; Manufacturer1 Example: TAIYO YUDEN; Manufacturer1 ComponentHeight: 2.7mm; HelpURL: \\cern.ch\dfs\Applications\Altium\Datasheets\CC1210_X5R_TAIYO-YUDEN_HIGH-VALUE.pdf; Author: CERN DEM MR; CreateDate: 03.02.2016; LatestRevisionDate: 03.02.2016
C162 = CC0805_360PF_50V_5%_C0G: as C248 on sheet PM12_P3V8; Part Number: CC0805_360PF_50V_5%_C0G; Component Kind: Standard; Component Type: Standard; Pin Count: 2; Value: 360pF; Status: None; Manufacturer Part Number: CC0805_360PF_50V_5%_C0G; Case: 0805; Mounted: Yes; Socket: No; SMD: Yes; Sense: No; Manufacturer1 Example: YAGEO PHYCOMP; Manufacturer1 ComponentHeight: 1.45mm; HelpURL: \\cern.ch\dfs\Applications\Altium\Datasheets\CC0805_NP0_YAGEO.pdf; Author: CERN DEM HF; CreateDate: 30.05.2024; LatestRevisionDate: 30.05.2024
C163 = CC0805_1UF_25V_10%_X7R: as C95 on sheet PM12_LDO; Part Number: CC0805_1UF_25V_10%_X7R; Component Kind: Standard; Component Type: Standard; Pin Count: 2; Value: 1uF; Status: Preferred; Manufacturer Part Number: CC0805_1UF_25V_10%_X7R; Case: 0805; Mounted: Yes; Socket: No; SMD: Yes; Sense: No; Manufacturer1 Example: KEMET; Manufacturer1 ComponentHeight: 1.4mm; HelpURL: \\cern.ch\dfs\Applications\Altium\Datasheets\CC0805_X7R_KEMET.pdf; Author: CERN DEM JLC; CreateDate: 23.03.2009; LatestRevisionDate: 23.03.2009
C164 = CC0805_4.7NF_50V_10%_X7R: as C250 on sheet PM12_P3V8; Part Number: CC0805_4.7NF_50V_10%_X7R; Component Kind: Standard; Component Type: Standard; Pin Count: 2; Value: 4.7nF; Status: Preferred; Manufacturer Part Number: CC0805_4.7NF_50V_10%_X7R; Case: 0805; Mounted: Yes; Socket: No; SMD: Yes; Sense: No; Manufacturer1 Example: PHYCOMP; Manufacturer1 ComponentHeight: 0.94mm; HelpURL: \\cern.ch\dfs\Applications\Altium\Datasheets\CC0805_X7R_PHYCOMP.pdf; Author: CERN DEM JLC; CreateDate: 03.12.2007; LatestRevisionDate: 03.12.2007
C165 = CC0805_100NF_50V_10%_X7R: as C251 on sheet PM12_P3V8; Part Number: CC0805_100NF_50V_10%_X7R; Component Kind: Standard; Component Type: Standard; Pin Count: 2; Value: 100nF; Status: None; Manufacturer Part Number: CC0805_100NF_50V_10%_X7R; Case: 0805; Mounted: Yes; Socket: No; SMD: Yes; Sense: No; Manufacturer1 Example: TDK; Manufacturer1 ComponentHeight: 1mm; HelpURL: \\cern.ch\dfs\Applications\Altium\Datasheets\CC0805_X7R_TDK_C.pdf; Author: CERN DEM JLC; CreateDate: 03.12.2007; LatestRevisionDate: 22.04.2015
C166 = CC0805_10NF_50V_10%_X7R: as C252 on sheet PM12_P3V8; Part Number: CC0805_10NF_50V_10%_X7R; Component Kind: Standard; Component Type: Standard; Pin Count: 2; Value: 10nF; Status: Preferred; Manufacturer Part Number: CC0805_10NF_50V_10%_X7R; Case: 0805; Mounted: Yes; Socket: No; SMD: Yes; Sense: No; Manufacturer1 Example: KEMET; Manufacturer1 ComponentHeight: 0.88mm; HelpURL: \\cern.ch\dfs\Applications\Altium\Datasheets\CC0805_X7R_KEMET.pdf; Author: CERN DEM JLC; CreateDate: 03.12.2007; LatestRevisionDate: 22.04.2015
C167 = CC0805_100PF_50V_5%_NP0: as C260 on sheet PM12_P3V8; Part Number: CC0805_100PF_50V_5%_NP0; Component Kind: Standard; Component Type: Standard; Pin Count: 2; Value: 100pF; Status: Preferred; Manufacturer Part Number: CC0805_100PF_50V_5%_NP0; Case: 0805; Mounted: Yes; Socket: No; SMD: Yes; Sense: No; Manufacturer1 Example: PHYCOMP; Manufacturer1 ComponentHeight: 1.35mm; HelpURL: \\cern.ch\dfs\Applications\Altium\Datasheets\CC0805_NP0_PHYCOMP.pdf; Author: CERN DEM JLC; CreateDate: 03.12.2007; LatestRevisionDate: 03.12.2007
DA11 = LM21215AMHX-1: as DA13 on sheet PM12_P3V3; Part Number: LM21215AMHX-1; Component Kind: Standard; Component Type: Standard; Device: LM21215AMHX-1; PackageDescription: TEXAS Case Style PWP0020AA, SOP, 0.65mm Pitch; 20 Pin, 4.40mm W X 6.50mm L X 1.10mm H body (w/thermal tab 3.4mm X 4.6mm  ), IPC Medium Density; Manufacturer Part Number: LM21215AMHX-1; Pin Count: 21; Case: TSSOP20; Mounted: Yes; Socket: No; SMD: Yes; Sense: No; ComponentHeight: 1.1mm; HelpURL: \\cern.ch\dfs\Applications\Altium\Datasheets\LM21215AMHX-1.pdf; Author: CERN DEM HF; CreateDate: 05.06.2024; LatestRevisionDate: 05.06.2024
L11 = IND6767_4.7UH_20%_VISHAY_IHLP-6767GZ-11: as L13 on sheet PM12_P3V3; Part Number: IND6767_4.7UH_20%_VISHAY_IHLP-6767GZ-11; Component Kind: Standard; Component Type: Standard; Pin Count: 2; Value: 4.7uH; Case: 6767; Mounted: Yes; Socket: No; SMD: Yes; Sense: No; ComponentHeight: 7mm; HelpURL: \\cern.ch\dfs\Applications\Altium\Datasheets\IND_VISHAY_IHLP-6767GZ-11.pdf; Author: CERN DEM HF; CreateDate: 04.06.2024; LatestRevisionDate: 04.06.2024
R74 = R2512_0R001_1%_3W_50PPM_BOURNS_CRE2512: as R15 on sheet PM12_P3V8; Part Number: R2512_0R001_1%_3W_50PPM_BOURNS_CRE2512; Component Kind: Standard; Component Type: Standard; Pin Count: 2; Value: 0R001; Status: None; Case: 2512; Mounted: Yes; Sense: No; Socket: No; SMD: Yes; ComponentHeight: 0.9mm; HelpURL: \\cern.ch\dfs\Applications\Altium\Datasheets\R2512_BOURNS_CRE2512.pdf; Author: CERN DEM BC; CreateDate: 13.10.2021; LatestRevisionDate: 13.10.2021
R75 = R0805_1R_1%_0.125W_100PPM: as R58 on sheet PM12_LDO; Part Number: R0805_1R_1%_0.125W_100PPM; Component Kind: Standard; Component Type: Standard; Pin Count: 2; Value: 1; Status: None; Manufacturer Part Number: R0805_1R_1%_0.125W_100PPM; Case: 0805; Mounted: Yes; Sense: No; Socket: No; SMD: Yes; Manufacturer1 Example: VISHAY; Manufacturer1 ComponentHeight: 0.6mm; HelpURL: \\cern.ch\dfs\Applications\Altium\Datasheets\R0805_VISHAY_CRCW e3.pdf; Author: CERN DEM HF; CreateDate: 07.06.2024; LatestRevisionDate: 07.06.2024
R76 = R0805_5R1_1%_0.125W_100PPM: as R18 on sheet PM12_P3V8; Part Number: R0805_5R1_1%_0.125W_100PPM; Component Kind: Standard; Component Type: Standard; Pin Count: 2; Value: 5R1; Status: None; Manufacturer Part Number: R0805_5R1_1%_0.125W_100PPM; Case: 0805; Mounted: Yes; Sense: No; Socket: No; SMD: Yes; Manufacturer1 Example: VISHAY; Manufacturer1 ComponentHeight: 0.6mm; HelpURL: \\cern.ch\dfs\Applications\Altium\Datasheets\R0805_VISHAY_CRCW-HP e3.pdf; Author: CERN DEM HF; CreateDate: 07.06.2024; LatestRevisionDate: 07.06.2024
R77 R79 R80 = R0805_10K_1%_0.125W_100PPM: as R97 on sheet PM12_Supply_LED; Part Number: R0805_10K_1%_0.125W_100PPM; Component Kind: Standard; Component Type: Standard; Pin Count: 2; Value: 10k; Status: Preferred; Manufacturer Part Number: R0805_10K_1%_0.125W_100PPM; Case: 0805; Mounted: Yes; Sense: No; Socket: No; SMD: Yes; Manufacturer1 Example: NIC COMPONENT; Manufacturer1 ComponentHeight: 0.6mm; HelpURL: \\cern.ch\dfs\Applications\Altium\Datasheets\R0805_NIC_NRC.pdf; Author: CERN DEM JLC; CreateDate: 03.12.2007; LatestRevisionDate: 13.03.2008
R78 = R0805_130R_1%_0.125W_100PPM: as R139 on sheet PM12_P3V8; Part Number: R0805_130R_1%_0.125W_100PPM; Component Kind: Standard; Component Type: Standard; Pin Count: 2; Value: 130; Status: Preferred; Manufacturer Part Number: R0805_130R_1%_0.125W_100PPM; Case: 0805; Mounted: Yes; Sense: No; Socket: No; SMD: Yes; Manufacturer1 Example: NIC COMPONENT; Manufacturer1 ComponentHeight: 0.6mm; HelpURL: \\cern.ch\dfs\Applications\Altium\Datasheets\R0805_NIC_NRC.pdf; Author: CERN DEM JLC; CreateDate: 03.12.2007; LatestRevisionDate: 13.03.2008
R83 = R0805_15K_1%_0.125W_100PPM: as R100 on sheet PM12_Supply_LED; Part Number: R0805_15K_1%_0.125W_100PPM; Component Kind: Standard; Component Type: Standard; Pin Count: 2; Value: 15k; Status: Preferred; Manufacturer Part Number: R0805_15K_1%_0.125W_100PPM; Case: 0805; Mounted: Yes; Sense: No; Socket: No; SMD: Yes; Manufacturer1 Example: NIC COMPONENT; Manufacturer1 ComponentHeight: 0.6mm; HelpURL: \\cern.ch\dfs\Applications\Altium\Datasheets\R0805_NIC_NRC.pdf; Author: CERN DEM JLC; CreateDate: 13.05.2013; LatestRevisionDate: 13.05.2013